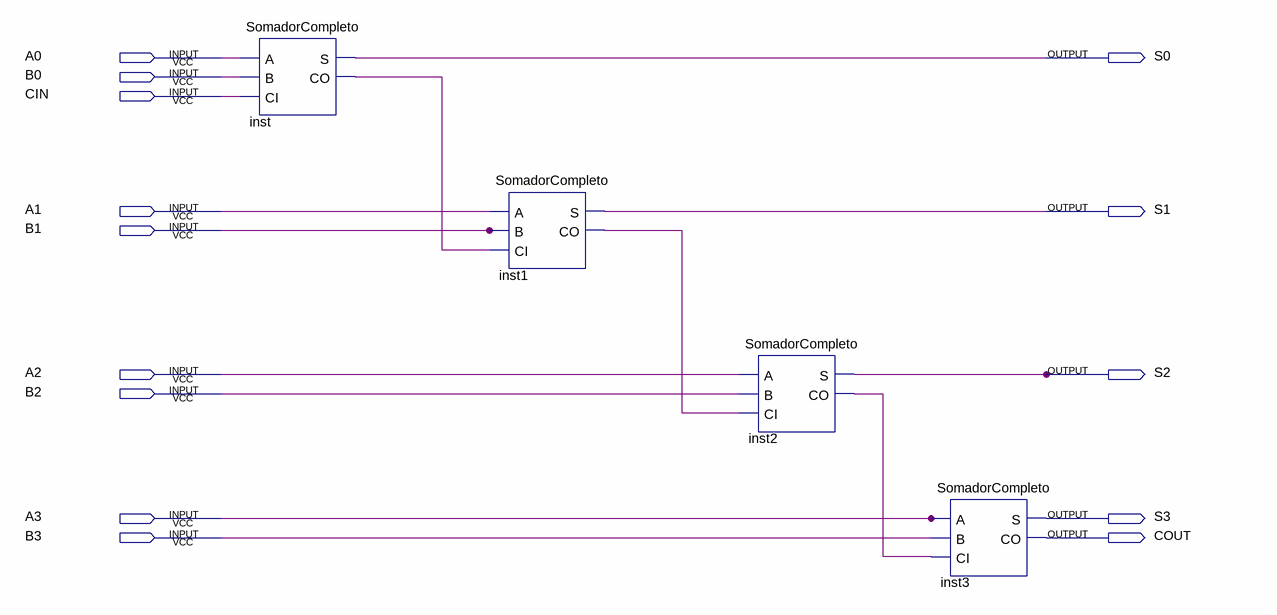
[diagram p0: schematic sheet]
// Quartus schematic Somador4Bits.bdf as structural Verilog: 4 symbols, 14 pins
module Somador4Bits (
  input  A0,
  input  B0,
  input  CIN,
  input  A1,
  input  B1,
  input  A2,
  input  B2,
  input  A3,
  input  B3,
  output S0,
  output S1,
  output S2,
  output S3,
  output COUT
);

  wire inst1_co, inst2_co, inst_co;

  SomadorCompleto inst (.A(A0), .B(B0), .CI(CIN), .S(S0), .CO(inst_co));
  SomadorCompleto inst1 (.A(A1), .B(B1), .CI(inst_co), .S(S1), .CO(inst1_co));
  SomadorCompleto inst2 (.A(A2), .B(B2), .CI(inst1_co), .S(S2), .CO(inst2_co));
  SomadorCompleto inst3 (.A(A3), .B(B3), .CI(inst2_co), .S(S3), .CO(COUT));
endmodule
